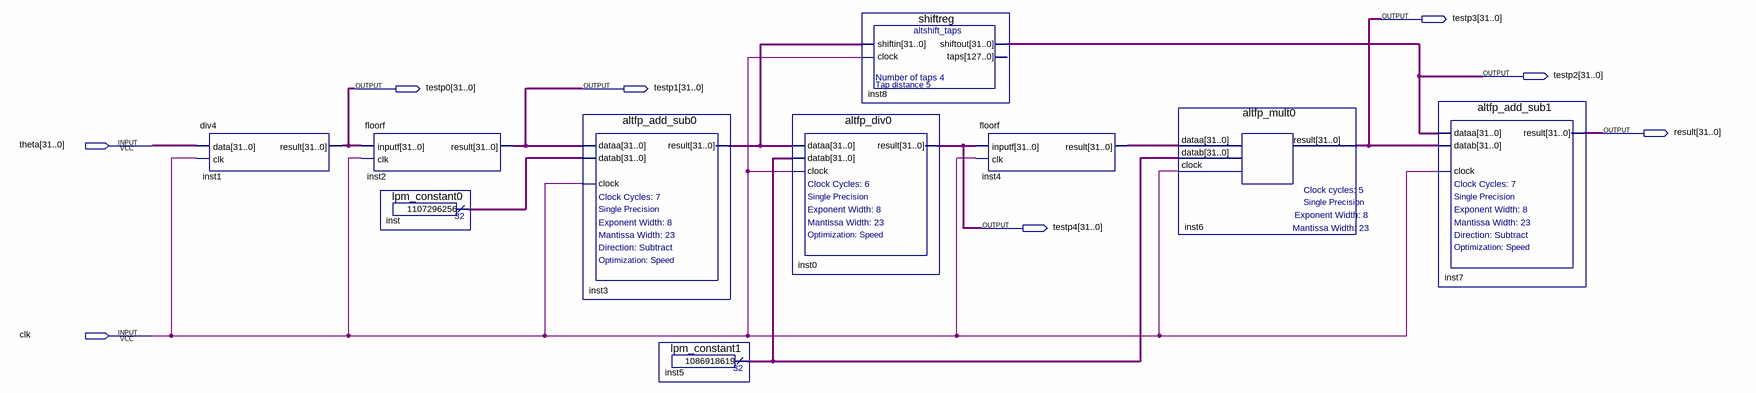
[diagram p0: schematic sheet]
// Quartus schematic CORDIC.bdf as structural Verilog: 10 symbols, 8 pins
module CORDIC (
  input  [31:0] theta,
  input  clk,
  output [31:0] testp3,
  output [31:0] testp2,
  output [31:0] testp0,
  output [31:0] testp1,
  output [31:0] result,
  output [31:0] testp4
);

  wire [31:0] inst3_result, inst4_result, inst5_result, inst_result;

  div4 inst1 (.data(theta), .clk(clk), .result(testp0));
  floorf inst2 (.inputf(testp0), .clk(clk), .result(testp1));
  lpm_constant0 inst (.result(inst_result));
  altfp_add_sub0 inst3 (.dataa(testp1), .datab(inst_result), .clock(clk), .result(inst3_result));
  lpm_constant1 inst5 (.result(inst5_result));
  altfp_div0 inst0 (.dataa(inst3_result), .datab(inst5_result), .clock(clk), .result(testp4));
  shiftreg inst8 (.shiftin(inst3_result), .clock(clk), .shiftout(testp2));  // open: taps
  floorf inst4 (.inputf(testp4), .clk(clk), .result(inst4_result));
  altfp_mult0 inst6 (.dataa(inst4_result), .datab(inst5_result), .clock(clk), .result(testp3));
  altfp_add_sub1 inst7 (.dataa(testp2), .datab(testp3), .clock(clk), .result(result));
endmodule
